# Altium schematic sheet LiPo_Charger.SchDoc: LiPo Charger
size 431 x 279 mm; VersionControl_RevNumber: 1.0; VersionControl_ProjFolderRevNumber: 1.0.0; ApprovedBy: ESE; CheckedBy: Justin, Bhagath; Author: Justin, bhagath; CompanyName: ESE Dept; DrawnBy: Justin, Bhagath; Engineer: Justin, Bhagath; Organization: ORGANIZATION; Address1: Electrical Engineering; Address2: 200 S 33rd St; Address3: Philadelphia; Address4: Pa 19104; DocumentNumber: 5; Revision: -; SheetNumber: 5; SheetTotal: 7; Project: ProtoWatch; ENG_APP_DATE: 02/12/21; DSN_APP_DATE: 02/12/21; CHK_APP_DATE: 02/12/21
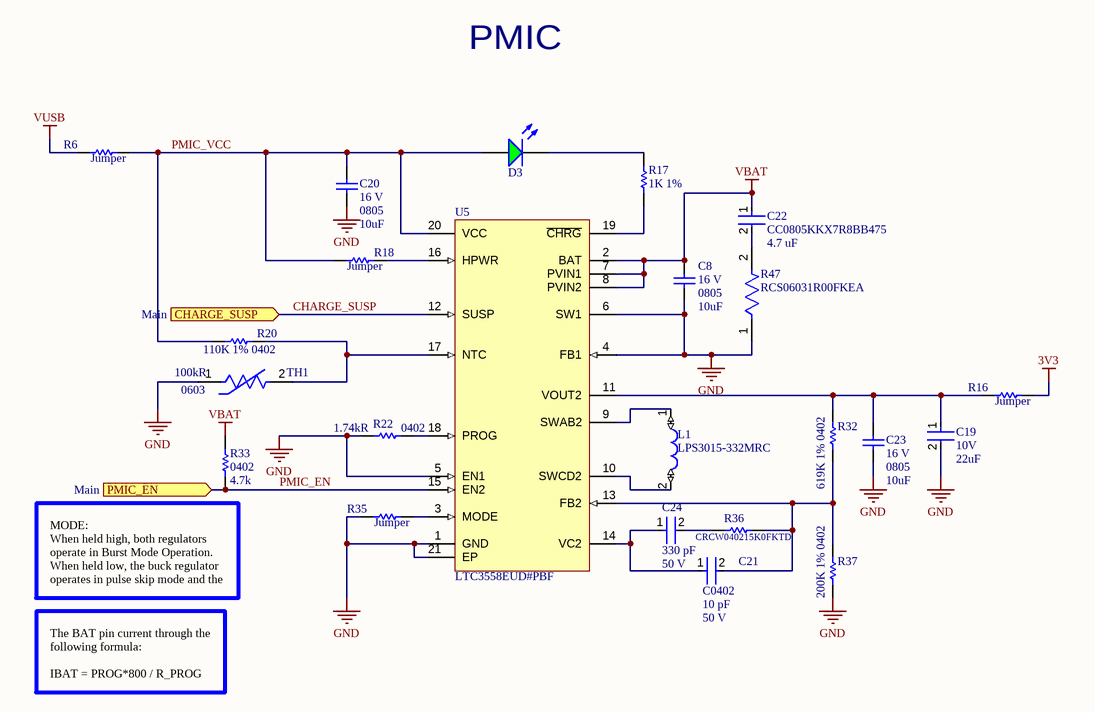
[diagram p0: LiPo_Charger.SchDoc]

## Parts
C8  value 10uF  Rated Voltage: 16 V  Case-EIA: 0805  [CAPC0805(2012)145_N]  (hidden comment: CAP 10uF 16V 0805(2012))
C19  Voltage Rating: 10V  Capacitance: 22uF  [FP-LMK107B-A-MFG]  (hidden comment: LMK107BBJ226MA-T)
C20  value 10uF  Rated Voltage: 16 V  Case-EIA: 0805  [CAPC0805(2012)145_N]  (hidden comment: CAP 10uF 16V 0805(2012))
C21  value 10 pF  Package: C0402  Voltage Rating: 50 V  [FP-C0402-BB-MFG]  (hidden comment: C0402C100D5GAC)
C22  CC0805KKX7R8BB475  Capacitance: 4.7 uF  [FP-CC0805-0_85-MFG]
C23  value 10uF  Rated Voltage: 16 V  Case-EIA: 0805  [CAPC0805(2012)145_N]  (hidden comment: CAP 10uF 16V 0805(2012))
C24  value 330 pF  Voltage Rating: 50 V  [FP-CC0402-MFG]  (hidden comment: CC0402KRX7R9BB331)
D3  LTST-C170GKT  [LTST-C170GKT_V]  (value not drawn)
L1  LPS3015-332MRC  [LPS3015]
R6  Jumper  [RESC0603(1608)_N]
R16  Jumper  [RESC0603(1608)_N]
R17  1K 1%  [RESC0603(1608)_N]
R18  Jumper  [RESC0603(1608)_N]
R20  110K 1% 0402  [RESC0402(1005)_M]
R22  Case/Package: 0402  Resistance: 1.74kR  [RESC1005X40X25LL05T05]  (hidden comment: CRCW04021K74FKED)
R32  619K 1% 0402  [RESC0402(1005)_L]
R33  Package Reference: 0402  Resistance (Ohms): 4.7k  [RESC1005X40X25LL10T15]  (hidden comment: RMCF0402JT4K70)
R35  Jumper  [RESC0603(1608)_N]
R36  CRCW040215K0FKTD  [RESC1005X40X25NL05T05]
R37  200K 1% 0402  [RESC0402(1005)_L]
R47  RCS06031R00FKEA  [FP-RCS0603-e3-MFG]
TH1  Case Code (Imperial): 0603  Resistance: 100kR  [FP-NCP18-0_15-MFG]  (hidden comment: NCP18WF104D03RB)
U5  LTC3558EUD#PBF  [LT-UD-20_N]

## Ports
CHARGE_SUSP (in, see Main), PMIC_EN (in, see Main)

## Nets
3V3: R16.2
GND: C8.1 C19.2 C20.1 C23.1 R22.1 R35.1 R37.2 R47.1 TH1.1 U5.1(GND) U5.4(FB1) U5.5(EN1) U5.6(SW1) U5.21(EP)
VBAT: C8.2 C22.1 R33.2 U5.2(BAT) U5.7(PVIN1) U5.8(PVIN2)
VUSB: R6.1
CHARGE_SUSP: U5.12(SUSP) ; port CHARGE_SUSP
PMIC_EN: R33.1 U5.15(EN2) ; port PMIC_EN
PMIC_VCC: C20.2 D3.1(A) R6.2 R18.1 R20.1 U5.20(VCC)
NetC19_1: C19.1 C23.2 R16.1 R32.2 U5.11(VOUT2)
NetC21_1: C21.1 C24.1 U5.14(VC2)
NetC21_2: C21.2 R32.1 R36.2 R37.1 U5.13(FB2)
NetC22_2: C22.2 R47.2
NetC24_2: C24.2 R36.1
NetD3_2: D3.2(K) R17.1
NetL1_1: L1.1 U5.9(SWAB2)
NetL1_2: L1.2 U5.10(SWCD2)
NetR17_2: R17.2 U5.19(~{CHRG})
NetR18_2: R18.2 U5.16(HPWR)
NetR20_2: R20.2 TH1.2 U5.17(NTC)
NetR22_2: R22.2 U5.18(PROG)
NetR35_2: R35.2 U5.3(MODE)

## Notes on the sheet
- PMIC
- (near R33) MODE:
  When held high, both regulators operate in Burst Mode Operation. When held low, the buck regulator operates in pulse skip mode and the buck-boost regulator operates in PWM mode.
- The BAT pin current through the following formula:
  IBAT = PROG*800 / R_PROG
- DWG. NO.
- REV.
- SHT.
- THIS DOCUMENT AND THE DATA DISCLOSED HEREIN OR HEREWITH IS THE PROPERTY OF ALTIUM LIMITED AND MAY BE FREELY DISTRIBUTED IN WHOLE. NO RIGHTS ARE RESERVED OR EXPRESS OR IMPLIED WARANTEE GIVEN.
- REVISION
- DESCRIPTION
- DATE
- APPROVED
- ENG:
- APPROVALS
- PROJECT
- DSN:
- CHK:
- REFERENCE DOCUMENTS
- PROJECT REVISION:
- TITLE
- DOCUMENT REVISION:
- DESIGN ITEM:
- BOM:
- FAB DWG:
- PCB DWG:
- ASSY DWG:
- SCALE:
- SIZE
- B
- CAGE CODE
- FILE NAME
- DWG NO.
- SHEET
- OF
- REV

## Library data of the parts
C8 C20 C23 = CMP-1036-04927-1: CAP 10uF 16V ±10% 0805 (2012 Metric) Thickness 1.45mm SMD; Manufacturer Part Number: CC0805KKX7R7BB106; Tolerance: Â±10%; Case-Metric: 2012; Technology: SMT; Max Thickness: 1.45 mm; Manufacturer: *
C19 = CMP-14477-000010-1: CAP CER 22UF 10V X5R 0603; Manufacturer: Taiyo Yuden; Tolerance: 20%; Temperature Coefficient: 15%; Material: Ceramic; Category: Cap; Temperature: -55°C to +85°C; Ipc Land Pattern Name: CAPC16080X80; ComponentLink2Description: Datasheet; Automotive: No; Temperature Range High: +85°C; Temperature Range Low: -55°C; Device Class L2: Capacitors; Octopart: https://octopart.com/lmk107bbj226ma-t-taiyo+yuden-76689223; Lead Free: Yes; ComponentLink2URL: https://ds.yuden.co.jp/TYCOMPAS/eu/download?pn=LMK107BBJ226MA-T&fileType=CS; Device Class L3: Ceramic Capacitors; Manufacturer Part Number: LMK107BBJ226MA-T; Package: LMK107B-A; Digikey Description: CAP CER 22UF 10V X5R 0603; Device Class L1: Passive Components; Value: 22uF; RoHS: TRUE; Height: 1mm; Temperature Characteristic: X5R
C21 = CMP-1034-00720-3: C0402 10 pF C0G 0.5 pF 50 V; Manufacturer: Kemet; Tolerance: 0.5 pF; Material: Ceramic; Ipc Land Pattern Name: CAPC10050X50; Device Class L2: Capacitors; Temperature Range High: +125°C; Height: 0.55mm; Temperature Characteristic: C0G; Automotive: No; Device Class L1: Passive Components; ComponentLink2URL: https://content.kemet.com/datasheets/KEM_C1002_X7R_SMD.pdf; Octopart: https://octopart.com/c0402c100d5gac-kemet-2680337; Temperature: -55°C to +125°C; Category: Cap; ComponentLink2Description: Datasheet; Manufacturer Part Number: C0402C100D5GAC; Capacitance: 10 pF; Device Class L3: Ceramic Capacitors; Lead Free: Yes; Temperature Range Low: -55°C; Mouser Description: Cap Ceramic 10pF 50V C0G 0.5pF SMD 0402 125°C Bulk; RoHS: TRUE
C22 = CMP-03422-000306-1: CAP CER 4.7UF 25V X7R 0805; Manufacturer: Yageo; Material: Ceramic; Tolerance: 0.1; ComponentLink2Description: Datasheet; Footprint Url: http://www.yageo.com/exep/pages/download/literatures/UPY-C_GEN_24.pdf; Temperature Range High: +85°C; Package: CC0805-0.85; Octopart: https://octopart.com/cc0805kkx7r8bb475-yageo-51849247; Mouser Description: Multilayer Ceramic Capacitors MLCC - SMD/SMT 4.7M pF 10% 25 Volts; Ipc Land Pattern Name: CAPC200125X85; Temperature: -30°C to +85°C; Digikey Description: CAP CER 4.7UF 25V X7R 0805; Temperature Characteristic: X7R; Temperature Range Low: -30°C; Lead Free: Yes; RoHS: TRUE; Device Class L3: Ceramic Capacitors; ComponentLink2URL: http://www.yageo.com/documents/recent/UPY-GPHC_Y5V_6.3V-to-50V_8.pdf; Category: Cap; Value: 4.7 uF; Device Class L2: Capacitors; Manufacturer Part Number: CC0805KKX7R8BB475; Device Class L1: Passive Components; Height: 0.95mm; Automotive: No; Voltage Rating: 25 V
C24 = CMP-03422-001282-1: CAP CER 330PF 50V X7R 0402; Manufacturer: YAGEO; Automotive Grade: NA; Temperature Coefficient: 30ppm/°C; Material: Ceramic; Tolerance: 0.1; Mouser Description: Multilayer Ceramic Capacitors MLCC - SMD/SMT 330pF 50V X7R 10%; ComponentLink2Description: Datasheet; Temperature Characteristic: X7R; Temperature Range High: +125°C; Capacitance: 330 pF; ComponentLink2URL: http://www.yageo.com/documents/recent/UPY-GP_NP0_16V-to-50V_16.pdf; Manufacturer Part Number: CC0402KRX7R9BB331; Digikey Description: CAP CER 330PF 50V X7R 0402; Temperature Range Low: -55°C; Device Class L1: Passive Components; Package: CC0402; Height: 0.55mm; Temperature: -55°C to +125°C; Category: Cap; Octopart: https://octopart.com/cc0402krx7r9bb331-yageo-192880; Footprint Url: http://www.yageo.com/exep/pages/download/literatures/UPY-C_GEN_24.pdf; Device Class L2: Capacitors; Device Class L3: Ceramic Capacitors; Ipc Land Pattern Name: CAPC10050X50; Automotive: No; Lead Free: Yes; RoHS: TRUE
D3 = CMP-1674-00002-5: LED Uni-Color Green, 100 mW, 120 mA, -55 to 85 degC, 2-Pin SMD, RoHS, Tape and Reel; Manufacturer: Lite-On; PackageReference: C170GKT; ComponentLink1Description: Manufacturer URL; ComponentLink1URL: http://www.us.liteon.com/; Height: 1.1 mm; PackageDescription: 2-Pin Surface Mount Device, Body 2 x 1.25 mm; RoHSCompliant: true; Package Quantity: 1; Packaging: Tape and Reel; Mount: Surface Mount; Min Operating Temperature: -55 degC; DatasheetVersion: 03/2003; Max Operating Temperature: 85 degC; Pins: 2; Mounting Technology: Surface Mount; Length: 2 mm; Colour: Green; ComponentLink2URL: http://media.digikey.com/pdf/Data%20Sheets/Lite-On%20PDFs/LTST-C170GKT.pdf; ComponentLink2Description: Datasheet
L1 = LPS3015-332MRC: Power inductor, shielded, 20% tol, SMT, RoHS, lead-free, halogen-free; MF: Coilcraft; SnapEDA_Link: https://www.snapeda.com/parts/LPS3015-104MRB/Coilcraft/view-part/1499066/?ref=snap; MP: LPS3015-332MRC; Price: None; Availability: Unavailable; Value: *; Package: None
R6 R16 R18 R35 = CMP-1012-00001-1: Jumper 0603 (1608 Metric); Case-Metric: 1608; Value: 0.00 Ohm; Power: None; Case-EIA: 0603; Technology: SMT; Tolerance: None
R17 = CMP-1012-00510-1: 1K 0.1W 1% 0603 (1608 Metric)  SMD; Case-Metric: 1608; Case-EIA: 0603; Value: 1000.00 Ohm; Technology: SMT; Tolerance: 1 %; Power: 0.1 W
R20 = CMP-1011-00740-1: 110K 0.063W 1% 0402 (1005 Metric)  SMD; Case-EIA: 0402; Case-Metric: 1005; Value: 110000.00 Ohm; Technology: SMT; Tolerance: 1 %; Power: 0.063 W
R22 = CMP-2002-08306-1: Manufacturer: Vishay Dale; Tolerance: 1%; Temperature Coefficient: 100ppm/°C; Max Power Dissipation: 63mW; Voltage Rating: 50V; Part Number: CRCW04021K74FKED; Supplier 1: Digi-Key; Supplier Part Number 1: 541-1.74KLCT-ND; Manufacturer Part Number: CRCW04021K74FKED; RoHS: Yes; Category: Chip SMD Resistors; Stock 1: 1825; Pricing 1: 1=0.10000, 10=0.03300, 100=0.01330, 1000=0.00596, 2500=0.00518, 5000=0.00428 (USD); Number of Pins: 2; Contact Plating: Tin; Weight: 2.3E-05oz; Case Code (Metric): 1005; Case Code (Imperial): 0402; Size Code: 0402; Min Operating Temperature: -55°C; Max Operating Temperature: 155°C; Packaging: Tape and Reel; Package Quantity: 10; Resistor Type: Thick Film; Number of Terminations: 2; Features: Automotive AEC-Q200; Series: CRCW; Power Rating: 63mW; Termination: SMD/SMT; Voltage Rating (DC): 50V; Resistance Tolerance: 1%; Construction: Rectangular; Length: 1mm; Width: 0.02inch; Height: 0.016inch; Depth: 0.5mm; Radiation Hardening: No; Lead Free: Lead Free; RoHS Compliant: Yes; REACH SVHC: Unknown; Military Standard: Not; ComponentLink1URL: https://datasheet.ciiva.com/2464/dcrcwe3-2464006.pdf?src-supplier=Digi-Key; ComponentLink1Description: https://datasheet.ciiva.com/2464/dcrcwe3-2464006.pdf?src-supplier=Digi-Key; ComponentLink2URL: https://datasheet.ciiva.com/2464/dcrcwe3-2464008.pdf?src-supplier=Digi-Key; ComponentLink2Description: https://datasheet.ciiva.com/2464/dcrcwe3-2464008.pdf?src-supplier=Digi-Key; ComponentLink3URL: https://datasheet.ciiva.com/5552/dcrcwe3-109170-5552093.pdf?src-supplier=Mouser; ComponentLink3Description: https://datasheet.ciiva.com/5552/dcrcwe3-109170-5552093.pdf?src-supplier=Mouser; ComponentLink4URL: https://datasheet.ciiva.com/7670/1533075-7670358.pdf?src-supplier=Element14; ComponentLink4Description: https://datasheet.ciiva.com/7670/1533075-7670358.pdf?src-supplier=Element14; ComponentLink5URL: https://datasheet.ciiva.com/2464/dcrcwe3-2464007.pdf?src-supplier=Digi-Key; ComponentLink5Description: https://datasheet.ciiva.com/2464/dcrcwe3-2464007.pdf?src-supplier=Digi-Key; ComponentLink6URL: https://datasheet.ciiva.com/22870/70201119-22870760.pdf?src-supplier=Allied+Electronics; ComponentLink6Description: https://datasheet.ciiva.com/22870/70201119-22870760.pdf?src-supplier=Allied+Electronics
R32 = CMP-1011-00826-1: 619K 0.063W 1% 0402 (1005 Metric)  SMD; Case-Metric: 1005; Value: 619000.00 Ohm; Case-EIA: 0402; Power: 0.063 W; Tolerance: 1 %; Technology: SMT
R33 = CMP-2000-06988-1: Chip Resistor, 4.7 KOhm, +/- 5%, 0.063 W, -55 to 155 degC, 0402 (1005 Metric), RoHS, Tape and Reel; Manufacturer: Stackpole-Electronics-Inc.; Temperature Coefficient: ±100ppm/°C; Power (Watts): 0.063W,1/16W; Tolerance: ±5%; Family: ChipResistor-SurfaceMount; Datasheet Version: 01/2017; Composition: ThickFilm; Operating Temperature: -55°C~155°C; Features: AutomotiveAEC-Q200; Datasheet URL: https://www.seielect.com/Catalog/SEI-RMCF_RMCP.pdf; Package Description: 2-Pin Surface Mount Device, Body 1 x 0.5 mm; Packaging: Digi-Reel®; Package / Case: 0402(1005Metric); Category: Resistors; Mounting Technology: SurfaceMount; Number of Terminations: 2; Supplier Device Package: 0402; Manufacturer URL: https://www.seielect.com/; Series: RMCF
R36 = CMP-1011-00641-2: Manufacturer: Vishay Dale; Part Number: CRCW040215K0FKTD
R37 = CMP-1011-00768-1: 200K 0.063W 1% 0402 (1005 Metric)  SMD; Value: 200000.00 Ohm; Case-Metric: 1005; Case-EIA: 0402; Tolerance: 1 %; Power: 0.063 W; Technology: SMT
R47 = CMP-02407-008073-1: RES SMD 1 OHM 1% 1/4W 0603; Resistance: 1R; Temperature Coefficient: 100ppm/°C; Max Power Dissipation: 250mW; Height: 0.02inch; Case Code (Metric): 1608; Length: 0.061inch; Composition: Thick Film; Tolerance: 1%; Min Operating Temperature: -55°C; Width: 0.033inch; Case Code (Imperial): 0603; Case/Package: 0603; Features: Automotive AEC-Q200; Max Operating Temperature: 155°C; Number of Terminations: 2; Packaging: Tape and Reel
TH1 = CMP-06022-000395-2: NTC Thermistor for Temperature Sensor, 0603, 100kΩ, 0.5%, 0.032mA, 5V; Max Power Dissipation: 100mW; Case Code (Metric): 1608; Length: 1.6mm; Termination: SMD/SMT; Case/Package: 0603; Tolerance: 0.5%; Width: 0.8mm; Packaging: Tape and Reel; Power Rating: 100mW; Package Quantity: 1; Number of Pins: 2; Height: 0.8mm; Min Operating Temperature: -40°C; Max Operating Temperature: 125°C; Mount: Surface Mount; Depth: 0.8mm
U5 = LTC3558EUD#PBF: Linear USB Battery Charger with Buck and Buck-Boost Regulator, 4.3 to 5.5 V Vin, 20-pin QFN (UD-20), -40 to 85 degC, Pb-Free; Manufacturer: Linear Technology; Number of Cells: 1; Vin Max(V): 5.5; Vin Min(V): 4.3; Number of Outputs: 2; Mounting Technology: Surface Mount; PartNumber: LTC3558EUD#PBF; PackageReference: UD-20; ComponentLink3URL: http://cds.linear.com/docs/en/packaging/QFN_20_05-08-1720.pdf; ComponentLink2Description: Datasheet; ComponentLink1URL: http://www.linear.com/; RoHS: TRUE; ComponentLink3Description: Package Specification; ComponentLink1Description: Manufacturer URL; PackageDescription: 20-Pin Plastic QFN, Body 3 x 3 mm, Pitch 0.4 mm; ComponentLink2URL: http://cds.linear.com/docs/en/datasheet/3558.pdf; PackageVersion: Rev. A, 06/2010